# Altium schematic sheet Power.SchDoc
size Letter
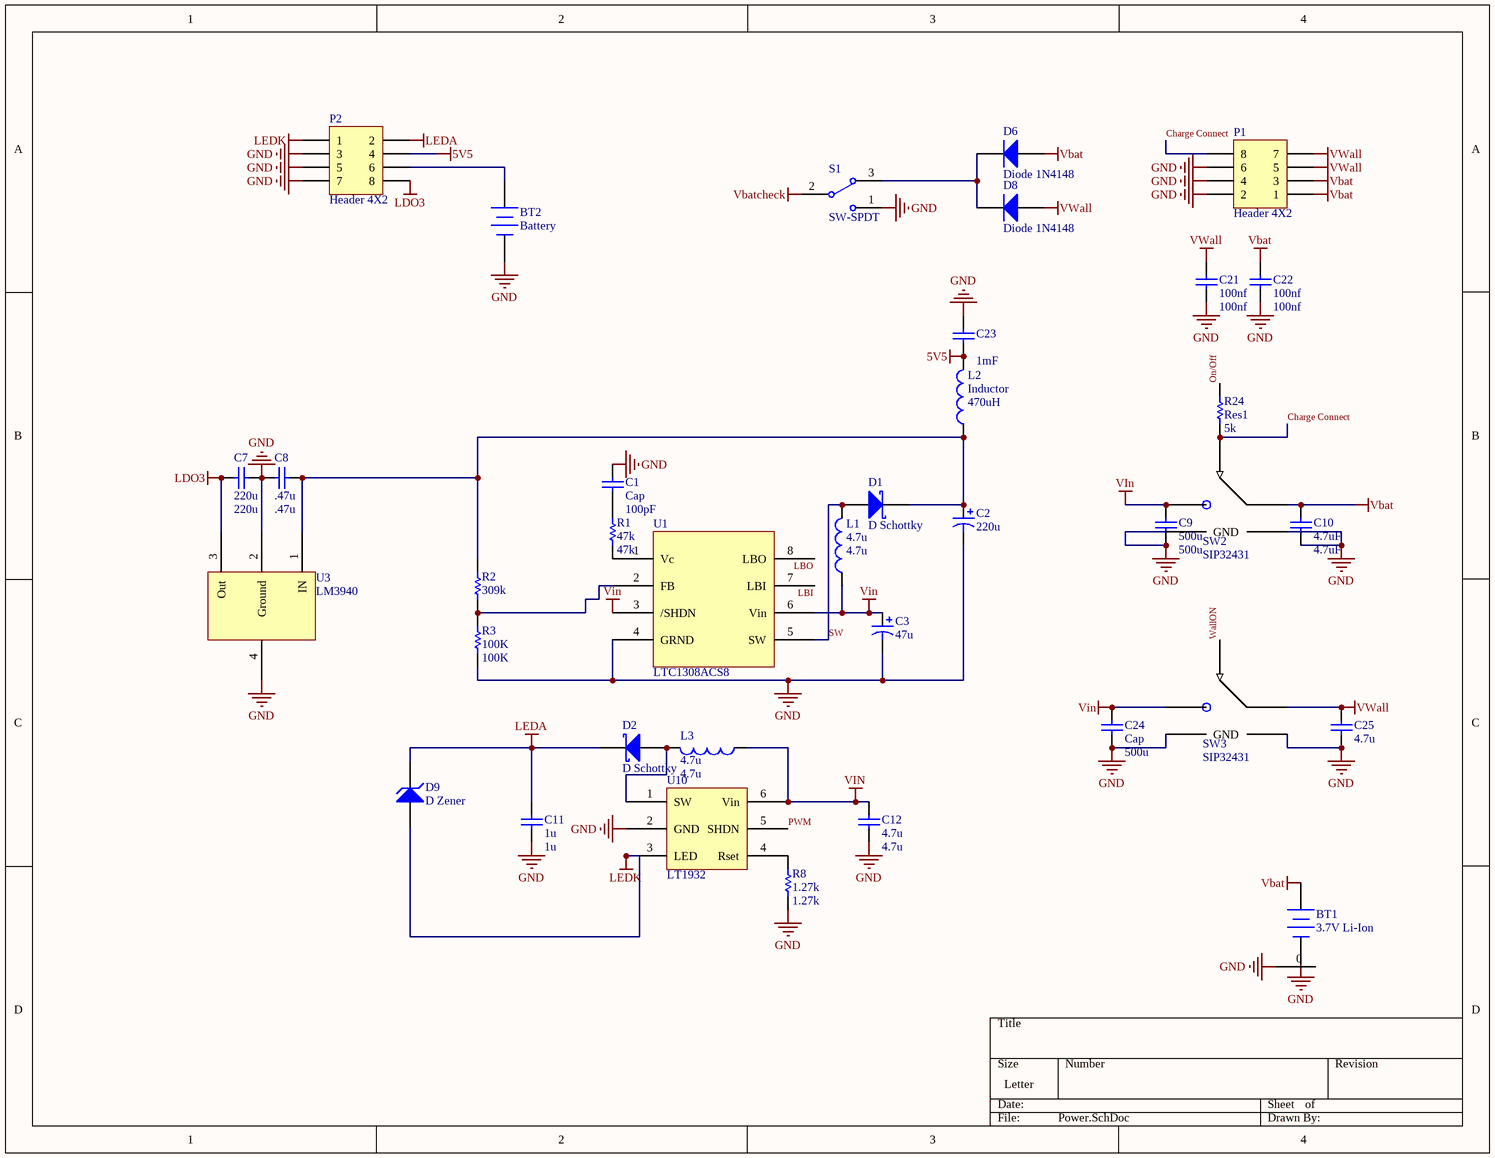
[diagram p0: Power.SchDoc]

## Parts
BT1  3.7V Li-Ion  [Batery Connector]
BT2  Battery  [10mm Coin Cell]
C1  Cap  value 100pF  [C0805]
C2  220u  [C2917]
C3  47u  [C2312]
C7  220u  [C2917]
C8  .47u  [C0805]
C9  500u  [C2917]
C10  4.7uF  [C0805]
C11  1u  [C1206]
C12  4.7u  [C0805]
C21  100nf  [C0805]
C22  100nf  [C0805]
C23  1mF  [C2917]
C24  Cap  value 500u  [C2917]
C25  4.7u  [C0805]
D1  D Schottky  [ShottkeyDiode]
D2  D Schottky  [ZHCSDiode]
D6  Diode 1N4148  [Diode]
D8  Diode 1N4148  [Diode]
D9  D Zener  [Zener]
L1  4.7u  [Inductor]
L2  Inductor  value 470uH  [470U inductor]
L3  4.7u  [Inductor]
P1  Header 4X2  [Molex MiniFit Jr8]
P2  Header 4X2  [Molex MiniFit Jr8]
R1  47k  [6-0805_M]
R2  309k  [6-0805_M]
R3  100K  [6-0805_M]
R8  1.27k  [6-0805_M]
R24  Res1  value 5k  [6-0805_M]
S1  SW-SPDT  [HDR1X3]
SW2  SIP32431  [SOT6 - duplicate]
SW3  SIP32431  [SOT6 - duplicate]
U1  LTC1308ACS8  [SOP8_LTC1308A]
U3  LM3940  [LDO]
U10  LT1932  [SOT6]

## Nets
5V5: C23.1 L2.2 P2.4
GND: BT1.0 BT1.2(-) BT2.2(-) C1.1 C2.2 C3.2 C7.2 C8.1 C9.1 C10.1 C11.1 C12.1 C21.1 C22.1 C23.2 C24.1 C25.1 P1.2 P1.4 P1.6 P2.3 P2.5 P2.7 R3.2 R8.1 S1.1 SW2.2(GND) SW2.5(GND) SW3.2(GND) SW3.5(GND) U1.4(GRND) U3.2(Ground) U3.4(Ground) U10.2(GND)
LDO3: C7.1 P2.8 U3.3(Out)
LEDA: C11.2 D2.2(K) D9.2(K) P2.2
LEDK: D9.1(A) P2.1 U10.3(LED)
Vbat: BT1.1(+) C10.2 C22.2 D6.A P1.1 P1.3 SW2.4(In)
Vbatcheck: S1.2
Vin: C3.1 C9.2 C12.2 C24.2 L1.1 L3.1 SW2.1(Out) SW3.1(Out) U1.3(/SHDN) U1.6(Vin) U10.6(Vin)
VWall: C21.2 C25.2 D8.A P1.5 P1.7 SW3.4(In)
Charge Connect: P1.8 R24.1 SW2.3
LBI: U1.7(LBI)
LBO: U1.8(LBO)
On/Off: R24.2
PWM: U10.5(SHDN)
SW: D1.A L1.2 U1.5(SW)
WallON: SW3.3
NetBT2_1: BT2.1(+) P2.6
NetC1_2: C1.2 R1.2
NetC2_1: C2.1 C8.2 D1.K L2.1 R2.1 U3.1(IN)
NetD2_1: D2.1(A) L3.2 U10.1(SW)
NetD6_K: D6.K D8.K S1.3
NetR1_1: R1.1 U1.1(Vc)
NetR2_2: R2.2 R3.1 U1.2(FB)
NetR8_2: R8.2 U10.4(Rset)

## Library data of the parts
BT1 BT2 = Battery: Multicell Battery; Published: 24-Mar-1999; LatestRevisionDate: 17-Jul-2002; LatestRevisionNote: Re-released for DXP Platform.; PackageReference: BAT-2; Publisher: Altium Limited; PackageDescription: Battery; 2 Leads
C1 C7-C12 C21-C25 = Cap: Capacitor; Published: 8-Jun-2000; LatestRevisionDate: 17-Jul-2002; LatestRevisionNote: Re-released for DXP Platform.; PackageReference: RAD-0.3; Publisher: Altium Limited; PackageDescription: Radial Cap, Thru-Hole; 2 Leads; 0.3 in Pin Spacing
  C7: Value: 220u
  C8: Value: .47u
  C9: Value: 500u
  C10: Value: 4.7uF
  C11: Value: 1u
  C12 C25: Value: 4.7u
  C21 C22: Value: 100nf
  C23: Value: 1mF
C2 C3 = Cap Pol1: Polarized Capacitor (Radial); Published: 8-Jun-2000; LatestRevisionDate: 17-Jul-2002; LatestRevisionNote: Re-released for DXP Platform.; PackageReference: RB7.6-15; Publisher: Altium Limited; PackageDescription: Polarized Capacitor (Radial); 2 Leads
  C2: Value: 220u
  C3: Value: 47u
D1 = D Schottky: Schottky Diode; Published: 8-Jun-2000; LatestRevisionDate: 17-Jul-2002; LatestRevisionNote: Re-released for DXP Platform.; PackageReference: SMB; Publisher: Altium Limited; PackageDescription: DO-214-AA/SMB; 2 C-Bend Leads; Body 5.3 x 3.6 mm, inc. leads (LxW); Code_JEDEC: DO-214-AA
D2 = D Schottky: Schottky Diode; pin to pad: 1>A 2>K; Published: 8-Jun-2000; LatestRevisionDate: 17-Jul-2002; LatestRevisionNote: Re-released for DXP Platform.; PackageReference: SMB; Publisher: Altium Limited; PackageDescription: DO-214-AA/SMB; 2 C-Bend Leads; Body 5.3 x 3.6 mm, inc. leads (LxW); Code_JEDEC: DO-214-AA
D6 D8 = Diode 1N4148: High Conductance Fast Diode; Published: 8-Jun-2000; LatestRevisionDate: 17-Jul-2002; LatestRevisionNote: Re-released for DXP Platform.; DatasheetVersion: 1997; PackageReference: DO-35; Publisher: Altium Limited; PackageDescription: Diode, Axial; Body 3.8 x 1.9 mm (LxDia. max), Lead Dia. 0.53 mm (max); Code_JEDEC: DO-204-AH; ComponentLink1Description: Manufacturer Link; ComponentLink1URL: http://www.fairchildsemi.com/; ComponentLink2Description: Datasheet; ComponentLink2URL: http://www.fairchildsemi.com/ds/1N%2F1N4148.pdf
D9 = D Zener: Zener Diode; Published: 8-Jun-2000; LatestRevisionDate: 17-Jul-2002; LatestRevisionNote: Re-released for DXP Platform.; PackageReference: DIODE-0.7; Publisher: Altium Limited; PackageDescription: Diode, Thru-Hole; 2 Leads; 0.7 in Pin Spacing
L1-L3 = Inductor: Code_IEC: 1005; Published: 8-Jun-2000; LatestRevisionDate: 29-May-2009; LatestRevisionNote: IPC-7351 Footprint Added.; PackageReference: 0402-A; Publisher: Altium Limited; PackageDescription: Chip Inductor; Code_JEITA: 0402
  L1 L3: Value: 4.7u
P1 P2 = Header 4X2: Header, 4-Pin, Dual row; LatestRevisionDate: 17-Jul-2002; LatestRevisionNote: Re-released for DXP Platform.; Publisher: Altium Limited
R1-R3 R8 R24 = Res1: Resistor; Published: 8-Jun-2000; LatestRevisionDate: 17-Jul-2002; LatestRevisionNote: Re-released for DXP Platform.; PackageReference: AXIAL-0.3; Publisher: Altium Limited; PackageDescription: Axial Device, Thru-Hole; 2 Leads; 0.3 in Pin Spacing
  R1: Value: 47k
  R2: Value: 309k
  R3: Value: 100K
  R8: Value: 1.27k
S1 = SW-SPDT: SPDT Subminiature Toggle Switch, Right Angle Mounting, Vertical Actuation; Published: 24-Mar-1999; LatestRevisionDate: 17-Dec-2003; LatestRevisionNote: Schematic revised, PCB Footprint replaced.; DatasheetVersion: 05-Dec-2000; PackageReference: TL36WW15050; Publisher: Altium Limited; PackageDescription: Switch; 4 Leads; ComponentLink1Description: Manufacturer Link; ComponentLink1URL: http://www.apem.com